# EAGLE design crossfire-20x20 (EAGLE 9.6.2)
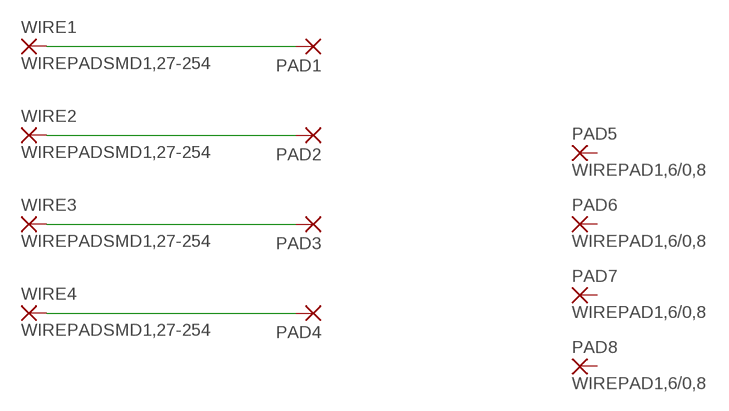
[diagram p0: schematic, sheet 1]

## Parts
PAD1  1,6/0,8  [1,6/0,8]
PAD2  1,6/0,8  [1,6/0,8]
PAD3  1,6/0,8  [1,6/0,8]
PAD4  1,6/0,8  [1,6/0,8]
PAD5  WIREPAD1,6/0,8  [1,6/0,8]
PAD6  WIREPAD1,6/0,8  [1,6/0,8]
PAD7  WIREPAD1,6/0,8  [1,6/0,8]
PAD8  WIREPAD1,6/0,8  [1,6/0,8]
WIRE1  WIREPADSMD1,27-254  [SMD1,27-2,54]
WIRE2  WIREPADSMD1,27-254  [SMD1,27-2,54]
WIRE3  WIREPADSMD1,27-254  [SMD1,27-2,54]
WIRE4  WIREPADSMD1,27-254  [SMD1,27-2,54]

## Nets
N$1: PAD1.1(P) WIRE1.1(P)
N$2: PAD2.1(P) WIRE2.1(P)
N$3: PAD3.1(P) WIRE3.1(P)
N$4: PAD4.1(P) WIRE4.1(P)
Unconnected: PAD5.1(P) PAD6.1(P) PAD7.1(P) PAD8.1(P)

## Library data of the parts
PAD1-PAD4 = wirepad:1,6/0,8: THROUGH-HOLE PAD
PAD5-PAD8 WIRE1-WIRE4 = wirepad:WIREPAD: Wire PAD connect wire on PCB

## Board
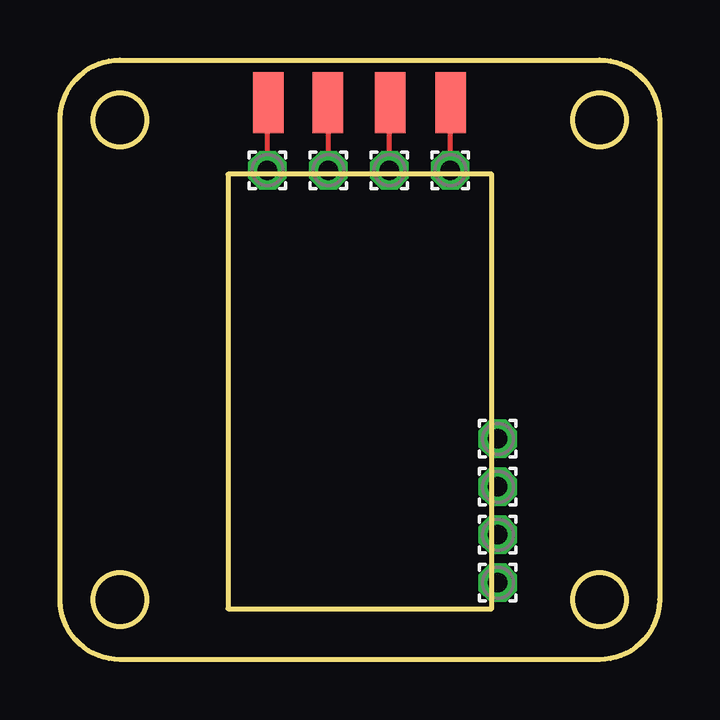
[diagram p1: board, top side]

Size 25 x 25 mm. Coordinates in mm from the lower left corner, seen from the top.
Outline: 22.5,0 2.5,0 arc-90 0,2.5 0,22.5 arc-90 2.5,25 22.5,25 arc-90 25,22.5 25,2.5 arc-90 22.5,0
Outline: circle at 2.5,2.5 radius 1.12
Outline: circle at 22.5,2.5 radius 1.12
Outline: circle at 22.5,22.5 radius 1.12
Outline: circle at 2.5,22.5 radius 1.12
Copper layers (1*16): Top 0.035559375mm / dielectric 1.6mm / Bottom 0.035559375mm
Design rules "oshpark-2layer": minimum track width 6mil, minimum drill 10mil, track to track 6mil, track to pad 6mil, pad to pad 6mil, via to via 6mil, smd to smd 6mil, copper to edge 15mil, drill to drill 6mil, minimum pad ring 5mil, minimum via ring 5mil, stop-mask expansion 2.5mil, vias tented up to drill 0mil, thermal gap 10mil
Milling: 4 lines

### Footprints (pad centres in the part's own frame; a part is rotated, then mirrored left to right if it is on the bottom)
1,6/0,8 = drill 0.813 pad 1.6 octagon: 1 0,0
SMD1,27-2,54 = smd 1.27 x 2.54: 1 0,0

### Placement (x,y rotation side)
PAD1  8.65,20.4 0 top
PAD2  11.19,20.4 0 top
PAD3  13.73,20.4 0 top
PAD4  16.27,20.4 0 top
PAD5  18.25,3.2 0 top
PAD6  18.25,5.2 0 top
PAD7  18.25,7.2 0 top
PAD8  18.25,9.2 0 top
WIRE1  8.68,23.21 0 top
WIRE2  11.17,23.21 0 top
WIRE3  13.76,23.21 0 top
WIRE4  16.28,23.21 0 top

### Tracks (layer width: path | path; a pad name or v marks a point on that pad's centre or on a via)
N$1
  Top 0.203: PAD1.1 8.65,23.18
  Top 0.254: 8.65,23.18 WIRE1.1
N$2
  Top 0.203: PAD2.1 11.19,23.19
  Top 0.254: 11.19,23.19 WIRE2.1
N$3
  Top 0.203: PAD3.1 13.73,23.18
  Top 0.254: 13.73,23.18 WIRE3.1
N$4
  Top 0.203: PAD4.1 WIRE4.1
  Top 0.254: WIRE4.1